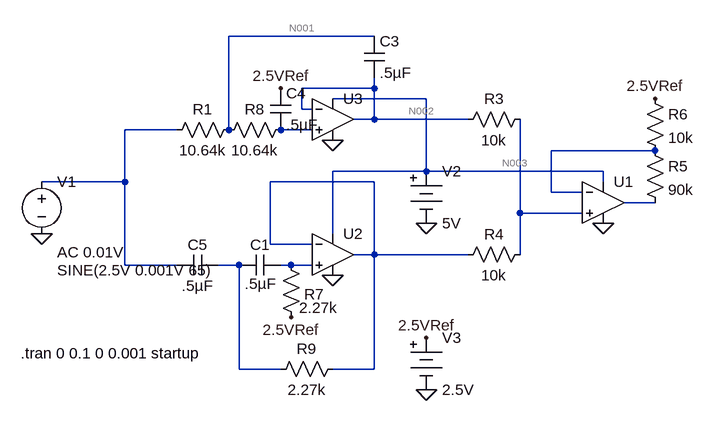
[diagram p0: schematic Band Stop Sallen Key.asc]
Band Stop Sallen Key.asc, the LTspice schematic file:
Version 4
SHEET 1 976 680
WIRE 480 -32 256 -32
WIRE 480 48 480 32
WIRE 480 48 368 48
WIRE 560 64 416 64
WIRE 368 80 368 48
WIRE 384 80 368 80
WIRE 480 96 480 48
WIRE 480 96 448 96
WIRE 624 96 480 96
WIRE 176 112 96 112
WIRE 256 112 256 -32
WIRE 384 112 336 112
WIRE 912 144 752 144
WIRE 560 176 560 64
WIRE 560 176 416 176
WIRE 832 176 560 176
WIRE 96 192 96 112
WIRE 96 192 -32 192
WIRE 480 192 320 192
WIRE 832 192 832 176
WIRE 752 208 752 144
WIRE 800 208 752 208
WIRE 912 224 864 224
WIRE 704 240 704 96
WIRE 800 240 704 240
WIRE 416 272 416 176
WIRE 320 288 320 192
WIRE 384 288 320 288
WIRE 480 304 480 192
WIRE 480 304 448 304
WIRE 624 304 480 304
WIRE 704 304 704 240
WIRE 96 320 96 192
WIRE 176 320 96 320
WIRE 272 320 240 320
WIRE 352 320 336 320
WIRE 384 320 352 320
WIRE 272 480 272 320
WIRE 336 480 272 480
WIRE 480 480 480 304
WIRE 480 480 416 480
FLAG -32 272 0
FLAG 416 336 0
FLAG 416 128 0
FLAG 832 256 0
FLAG 560 256 0
FLAG 560 512 0
FLAG 560 432 2.5VRef
FLAG 912 64 2.5VRef
FLAG 336 48 2.5VRef
FLAG 352 400 2.5VRef
SYMBOL res 272 96 R90
WINDOW 0 0 56 VBottom 2
WINDOW 3 32 56 VTop 2
SYMATTR InstName R1
SYMATTR Value 10.64k
SYMBOL voltage -32 176 R0
WINDOW 3 24 152 Left 2
WINDOW 123 24 124 Left 2
WINDOW 39 0 0 Left 2
SYMATTR Value SINE(2.5V 0.001V 65)
SYMATTR Value2 AC 0.01V
SYMATTR InstName V1
SYMBOL res 720 80 R90
WINDOW 0 0 56 VBottom 2
WINDOW 3 32 56 VTop 2
SYMATTR InstName R3
SYMATTR Value 10k
SYMBOL res 720 288 R90
WINDOW 0 0 56 VBottom 2
WINDOW 3 32 56 VTop 2
SYMATTR InstName R4
SYMATTR Value 10k
SYMBOL Misc\\battery 560 160 R0
WINDOW 123 0 0 Left 2
WINDOW 39 0 0 Left 2
SYMATTR InstName V2
SYMATTR Value 5V
SYMBOL Misc\\battery 560 416 R0
WINDOW 123 0 0 Left 2
WINDOW 39 0 0 Left 2
SYMATTR InstName V3
SYMATTR Value 2.5V
SYMBOL Opamps\\UniversalOpamp2 832 224 R0
SYMATTR InstName U1
SYMBOL Opamps\\UniversalOpamp2 416 304 R0
SYMATTR InstName U2
SYMBOL Opamps\\UniversalOpamp2 416 96 R0
SYMATTR InstName U3
SYMBOL res 896 128 R0
SYMATTR InstName R5
SYMATTR Value 90k
SYMBOL res 896 48 R0
SYMATTR InstName R6
SYMATTR Value 10k
SYMBOL cap 464 -32 R0
SYMATTR InstName C3
SYMATTR Value .5µF
SYMBOL cap 320 48 R0
SYMATTR InstName C4
SYMATTR Value .5µF
SYMBOL res 352 96 R90
WINDOW 0 0 56 VBottom 2
WINDOW 3 32 56 VTop 2
SYMATTR InstName R8
SYMATTR Value 10.64k
SYMBOL res 368 416 R180
WINDOW 0 -35 51 Left 2
WINDOW 3 -56 30 Left 2
SYMATTR InstName R7
SYMATTR Value 2.27k
SYMBOL cap 336 304 R90
WINDOW 0 0 32 VBottom 2
WINDOW 3 29 31 VTop 2
SYMATTR InstName C1
SYMATTR Value .5µF
SYMBOL cap 240 304 R90
WINDOW 0 0 32 VBottom 2
WINDOW 3 32 32 VTop 2
SYMATTR InstName C5
SYMATTR Value .5µF
SYMBOL res 432 464 R90
WINDOW 0 0 56 VBottom 2
WINDOW 3 32 56 VTop 2
SYMATTR InstName R9
SYMATTR Value 2.27k
TEXT -64 456 Left 2 !.tran 0 0.1 0 0.001 startup

The netlist it stands for:
* Band Stop Sallen Key.asc
R1 N001 N004 10.64k
V1 N004 0 SINE(2.5V 0.001V 65) AC 0.01V
R3 N009 N002 10k
R4 N009 N007 10k
V2 N003 0 5V
V3 2.5VRef 0 2.5V
XU1 N009 N006 N003 0 N008 level.2 Avol=1Meg GBW=10Meg Slew=10Meg ilimit=25m rail=0 Vos=0 phimargin=45 en=0 enk=0 in=0 ink=0 Rin=500Meg  ; pins IN+ IN- V+ V- OUT
XU2 N011 N007 N003 0 N007 level.2 Avol=1Meg GBW=10Meg Slew=10Meg ilimit=25m rail=0 Vos=0 phimargin=45 en=0 enk=0 in=0 ink=0 Rin=500Meg  ; pins IN+ IN- V+ V- OUT
XU3 N005 N002 N003 0 N002 level.2 Avol=1Meg GBW=10Meg Slew=10Meg ilimit=25m rail=0 Vos=0 phimargin=45 en=0 enk=0 in=0 ink=0 Rin=500Meg  ; pins IN+ IN- V+ V- OUT
R5 N006 N008 90k
R6 2.5VRef N006 10k
C3 N001 N002 .5µF
C4 2.5VRef N005 .5µF
R8 N005 N001 10.64k
R7 2.5VRef N011 2.27k
C1 N011 N010 .5µF
C5 N010 N004 .5µF
R9 N007 N010 2.27k
.tran 0 0.1 0 0.001 startup
.lib UniversalOpamps2.sub
.backanno
.end

* Results of the author's LTspice run, read from the files saved beside the schematic
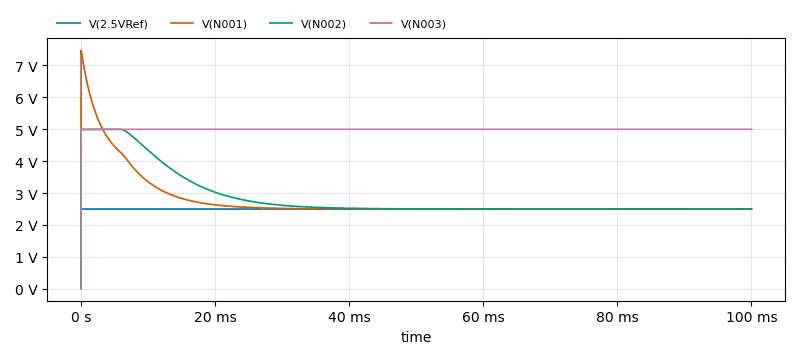
[diagram p1: Transient Analysis of Band Stop Sallen Key.asc, plotted from the saved traces]
* Transient Analysis, 1 run:
*   V(2.5VRef): min 0 V, max 2.5 V, average 2.5 V, rms 2.5 V, last 2.5 V
*   V(N001): min 2.5 V, max 7.474 V, average 2.766 V, rms 2.863 V, last 2.5 V
*   V(N002): min 0 V, max 4.997 V, average 2.881 V, rms 2.978 V, last 2.5 V
*   V(N003): min 0 V, max 5 V, average 4.999 V, rms 5 V, last 5 V